# Altium schematic sheet relays0 (jaanuse-raal's conflicted copy 2014-11-12).SchDoc
size A4
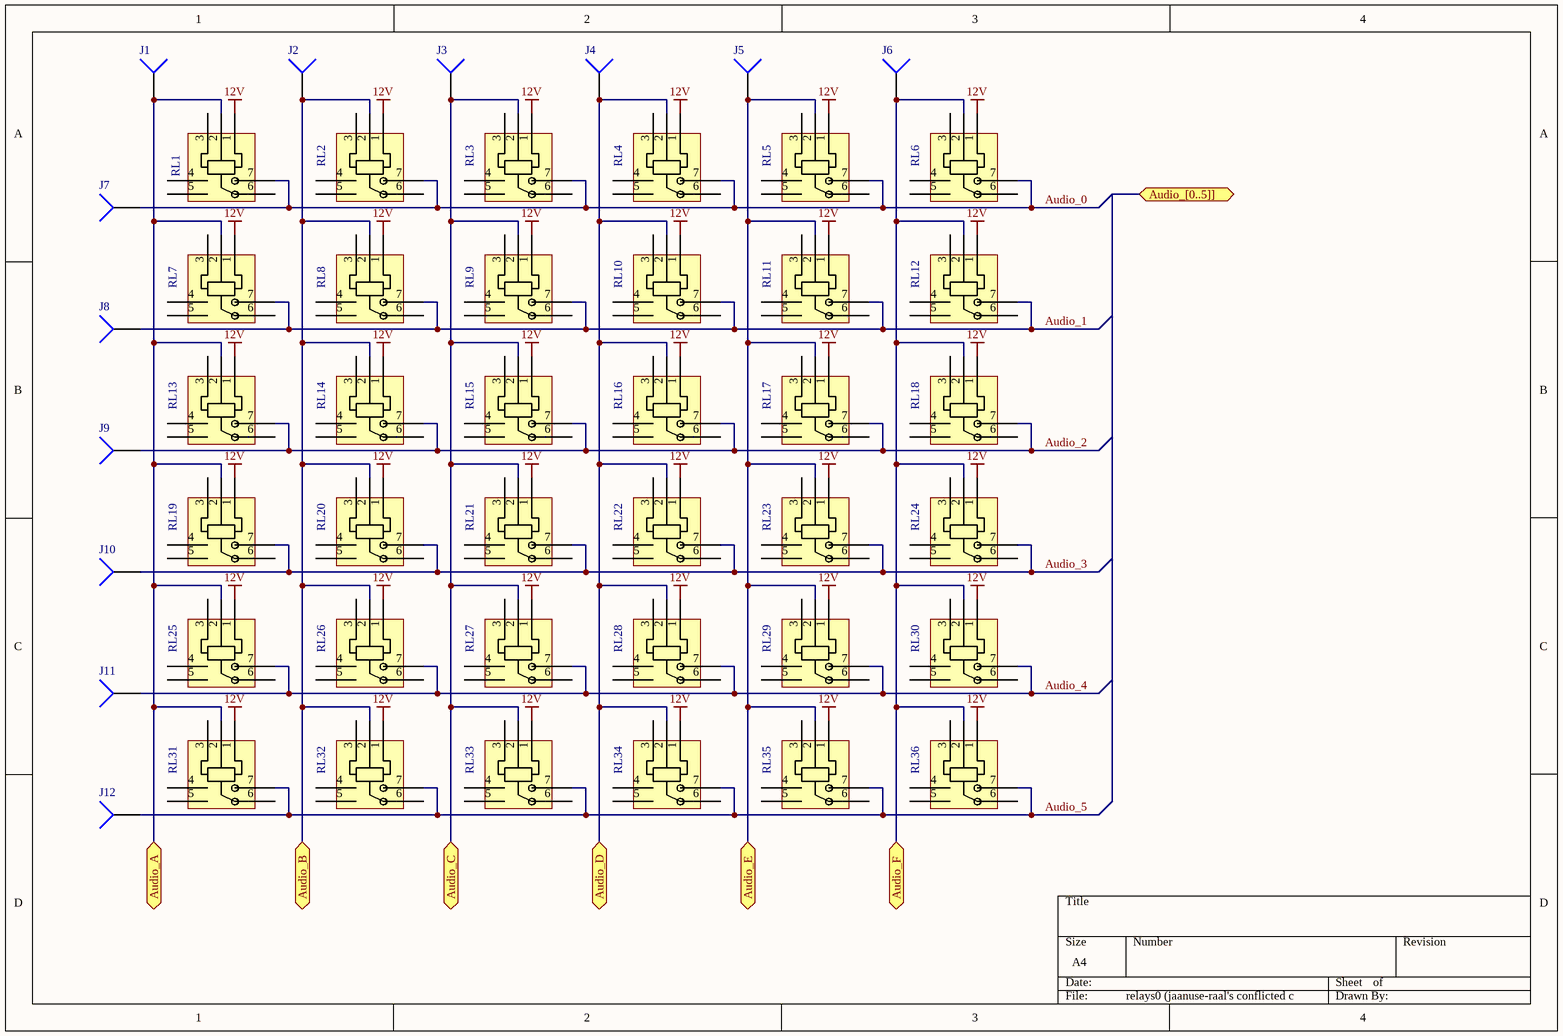
[diagram p0: relays0 (jaanuse-raal's conflicted copy 2014-11-12).SchDoc]

## Parts
J1  Audio  [PIN1]  (value not drawn)
J2  Audio  [PIN1]  (value not drawn)
J3  Audio  [PIN1]  (value not drawn)
J4  Audio  [PIN1]  (value not drawn)
J5  Audio  [PIN1]  (value not drawn)
J6  Audio  [PIN1]  (value not drawn)
J7  Audio  [PIN1]  (value not drawn)
J8  Audio  [PIN1]  (value not drawn)
J9  Audio  [PIN1]  (value not drawn)
J10  Audio  [PIN1]  (value not drawn)
J11  Audio  [PIN1]  (value not drawn)
J12  Audio  [PIN1]  (value not drawn)
RL1  Relay  [Relay_FRA3]  (value not drawn)
RL2  Relay  [Relay_FRA3]  (value not drawn)
RL3  Relay  [Relay_FRA3]  (value not drawn)
RL4  Relay  [Relay_FRA3]  (value not drawn)
RL5  Relay  [Relay_FRA3]  (value not drawn)
RL6  Relay  [Relay_FRA3]  (value not drawn)
RL7  Relay  [Relay_FRA3]  (value not drawn)
RL8  Relay  [Relay_FRA3]  (value not drawn)
RL9  Relay  [Relay_FRA3]  (value not drawn)
RL10  Relay  [Relay_FRA3]  (value not drawn)
RL11  Relay  [Relay_FRA3]  (value not drawn)
RL12  Relay  [Relay_FRA3]  (value not drawn)
RL13  Relay  [Relay_FRA3]  (value not drawn)
RL14  Relay  [Relay_FRA3]  (value not drawn)
RL15  Relay  [Relay_FRA3]  (value not drawn)
RL16  Relay  [Relay_FRA3]  (value not drawn)
RL17  Relay  [Relay_FRA3]  (value not drawn)
RL18  Relay  [Relay_FRA3]  (value not drawn)
RL19  Relay  [Relay_FRA3]  (value not drawn)
RL20  Relay  [Relay_FRA3]  (value not drawn)
RL21  Relay  [Relay_FRA3]  (value not drawn)
RL22  Relay  [Relay_FRA3]  (value not drawn)
RL23  Relay  [Relay_FRA3]  (value not drawn)
RL24  Relay  [Relay_FRA3]  (value not drawn)
RL25  Relay  [Relay_FRA3]  (value not drawn)
RL26  Relay  [Relay_FRA3]  (value not drawn)
RL27  Relay  [Relay_FRA3]  (value not drawn)
RL28  Relay  [Relay_FRA3]  (value not drawn)
RL29  Relay  [Relay_FRA3]  (value not drawn)
RL30  Relay  [Relay_FRA3]  (value not drawn)
RL31  Relay  [Relay_FRA3]  (value not drawn)
RL32  Relay  [Relay_FRA3]  (value not drawn)
RL33  Relay  [Relay_FRA3]  (value not drawn)
RL34  Relay  [Relay_FRA3]  (value not drawn)
RL35  Relay  [Relay_FRA3]  (value not drawn)
RL36  Relay  [Relay_FRA3]  (value not drawn)

## Ports
Audio_[0..5]] (bidir), Audio_A (bidir), Audio_B (bidir), Audio_C (bidir), Audio_D (bidir), Audio_E (bidir), Audio_F (bidir)

## Nets
12V: RL1.1 RL2.1 RL3.1 RL4.1 RL5.1 RL6.1 RL7.1 RL8.1 RL9.1 RL10.1 RL11.1 RL12.1 RL13.1 RL14.1 RL15.1 RL16.1 RL17.1 RL18.1 RL19.1 RL20.1 RL21.1 RL22.1 RL23.1 RL24.1 RL25.1 RL26.1 RL27.1 RL28.1 RL29.1 RL30.1 RL31.1 RL32.1 RL33.1 RL34.1 RL35.1 RL36.1
Audio_0: J7.1 RL1.7 RL2.7 RL3.7 RL4.7 RL5.7 RL6.7
Audio_1: J8.1 RL7.7 RL8.7 RL9.7 RL10.7 RL11.7 RL12.7
Audio_2: J9.1 RL13.7 RL14.7 RL15.7 RL16.7 RL17.7 RL18.7
Audio_3: J10.1 RL19.7 RL20.7 RL21.7 RL22.7 RL23.7 RL24.7
Audio_4: J11.1 RL25.7 RL26.7 RL27.7 RL28.7 RL29.7 RL30.7
Audio_5: J12.1 RL31.7 RL32.7 RL33.7 RL34.7 RL35.7 RL36.7
Audio_A: J1.1 RL1.2 RL7.2 RL13.2 RL19.2 RL25.2 RL31.2 ; port Audio_A
Audio_B: J2.1 RL2.2 RL8.2 RL14.2 RL20.2 RL26.2 RL32.2 ; port Audio_B
Audio_C: J3.1 RL3.2 RL9.2 RL15.2 RL21.2 RL27.2 RL33.2 ; port Audio_C
Audio_D: J4.1 RL4.2 RL10.2 RL16.2 RL22.2 RL28.2 RL34.2 ; port Audio_D
Audio_E: J5.1 RL5.2 RL11.2 RL17.2 RL23.2 RL29.2 RL35.2 ; port Audio_E
Audio_F: J6.1 RL6.2 RL12.2 RL18.2 RL24.2 RL30.2 RL36.2 ; port Audio_F

Not connected (* = marked no-connect by the designer): RL1 3 4 5 6; RL2 3 4 5 6; RL3 3 4 5 6; RL4 3 4 5 6; RL5 3 4 5 6; RL6 3 4 5 6; RL7 3 4 5 6; RL8 3 4 5 6; RL9 3 4 5 6; RL10 3 4 5 6; RL11 3 4 5 6; RL12 3 4 5 6; RL13 3 4 5 6; RL14 3 4 5 6; RL15 3 4 5 6; RL16 3 4 5 6; RL17 3 4 5 6; RL18 3 4 5 6; RL19 3 4 5 6; RL20 3 4 5 6; RL21 3 4 5 6; RL22 3 4 5 6; RL23 3 4 5 6; RL24 3 4 5 6; RL25 3 4 5 6; RL26 3 4 5 6; RL27 3 4 5 6; RL28 3 4 5 6; RL29 3 4 5 6; RL30 3 4 5 6; RL31 3 4 5 6; RL32 3 4 5 6; RL33 3 4 5 6; RL34 3 4 5 6; RL35 3 4 5 6; RL36 3 4 5 6

## Library data of the parts
J1-J12 = Socket: LatestRevisionDate: 17-Jul-2002; LatestRevisionNote: Re-released for DXP Platform.; Publisher: Altium Limited
RL1-RL36 = Relay_FRA3: Miniature power relay; Part number: FRA3C-DC12